# Altium schematic sheet Power.SchDoc
size A3; Author: Ali Zoubir; Organization: ETML-ES; Address1: Avenue Recordon 1; Address2: 1004 Lausanne; Address3: Switzerland; Revision: 2221; SheetNumber: 6; SheetTotal: 6; Version: V0
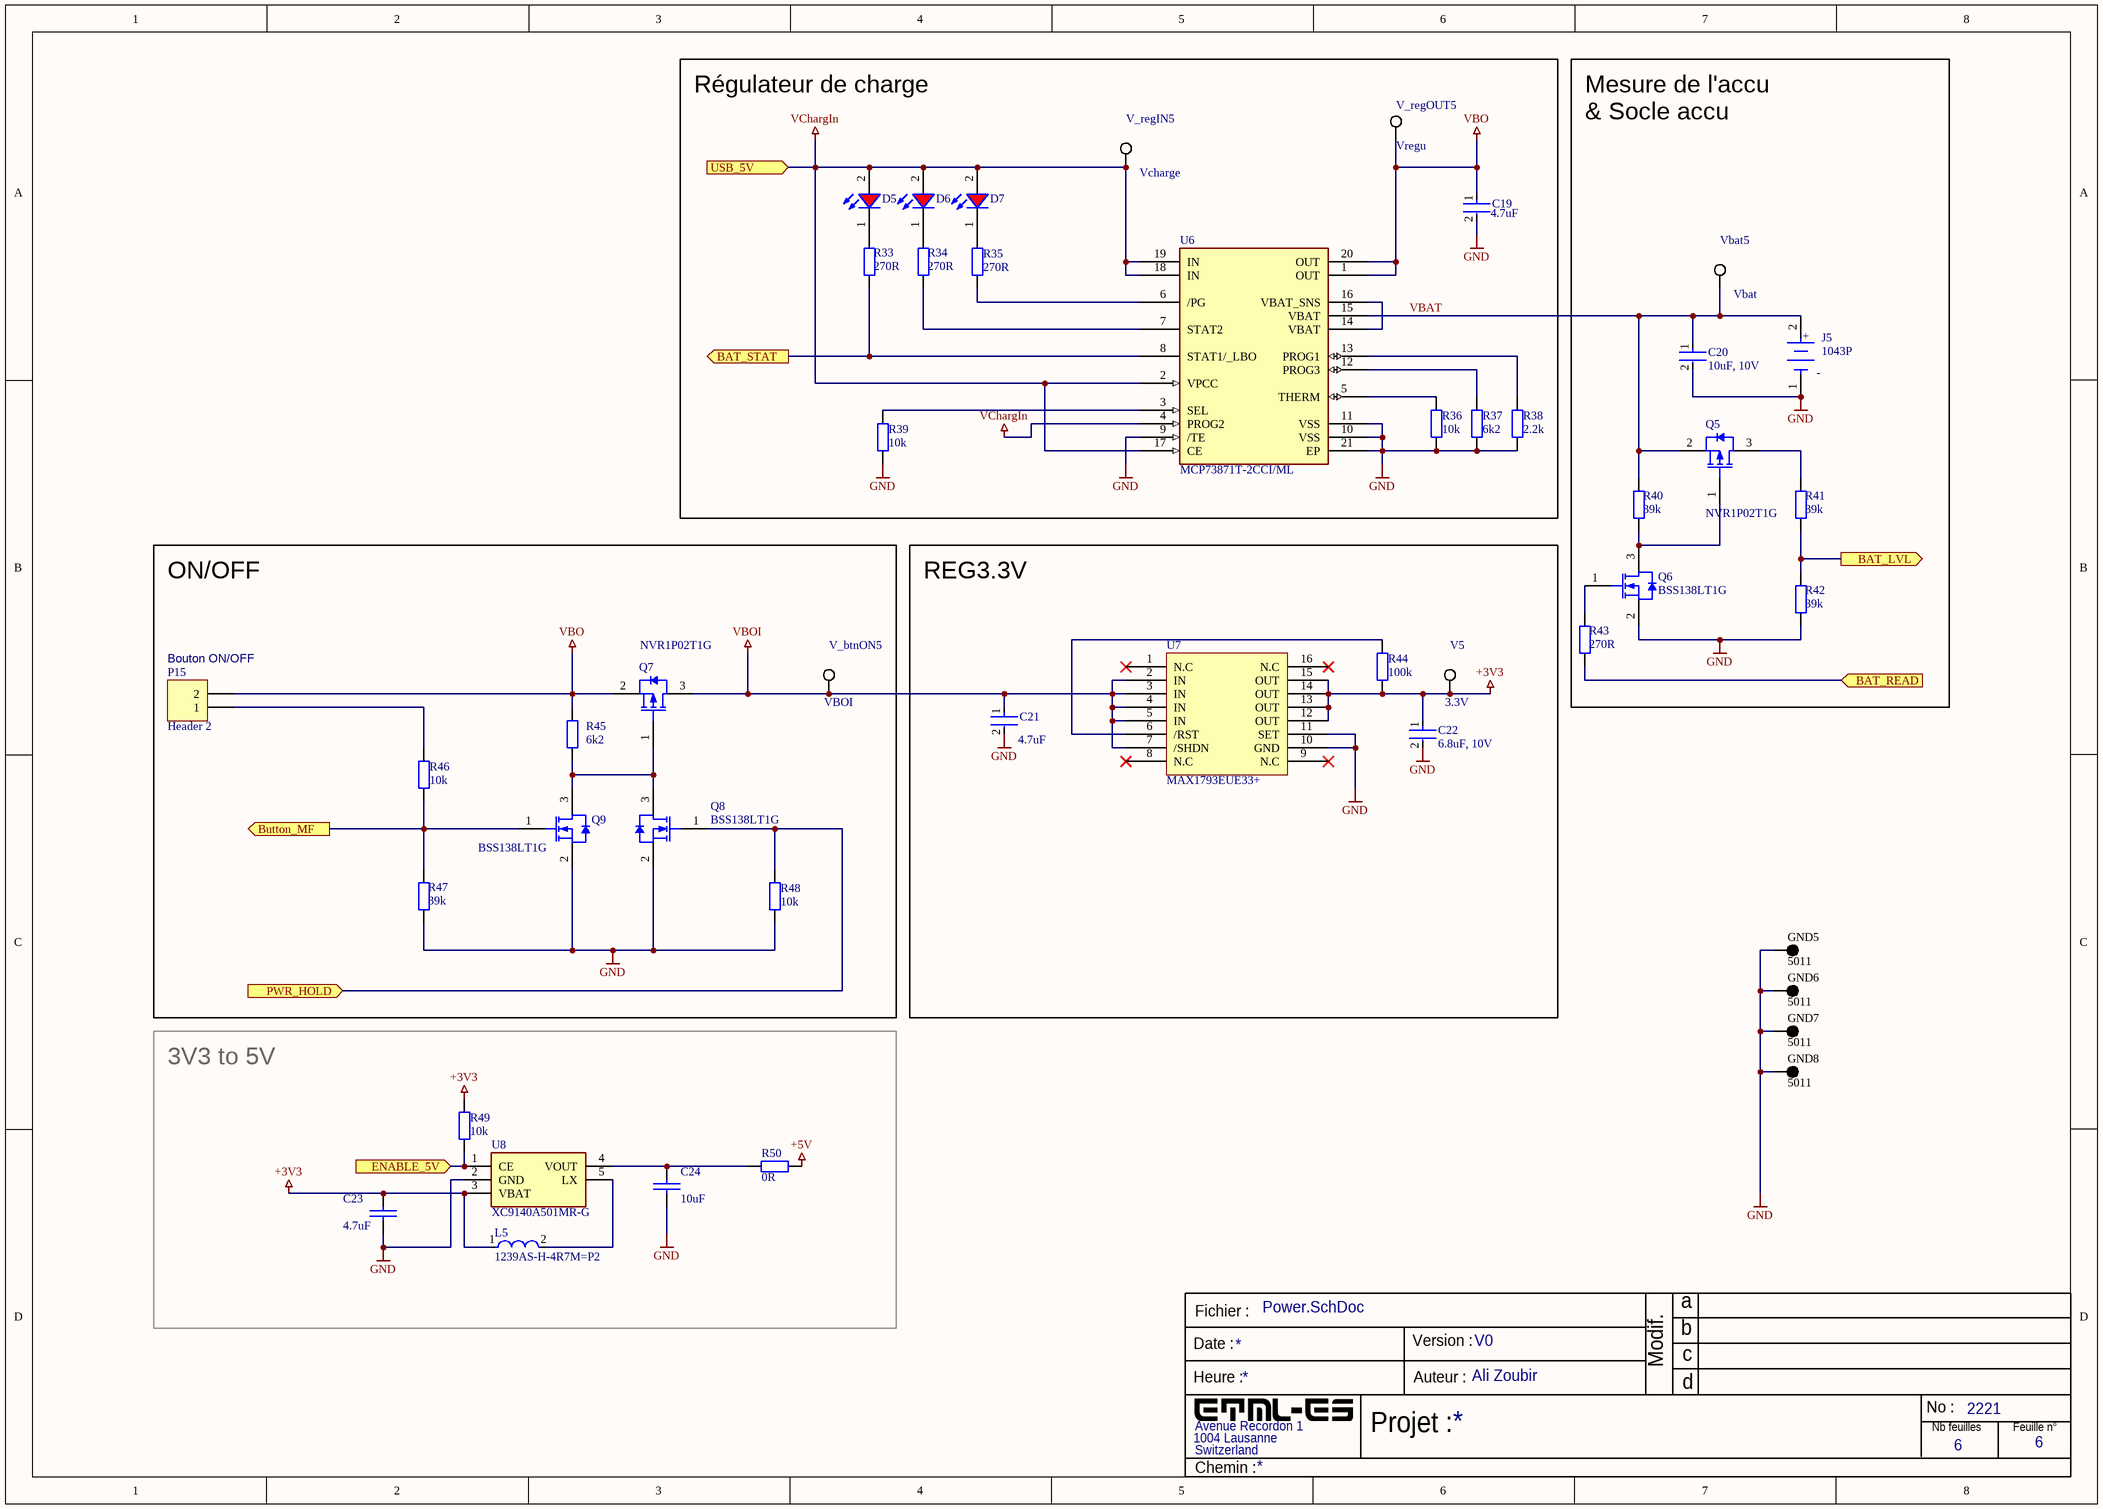
[diagram p0: Power.SchDoc]

## Parts
C19  Capacitance: 4.7uF  [6-0805_L]  (hidden comment: 4.7uF, 35V)
C20  10uF, 10V  [6-0805_L]
C21  Capacitance: 4.7uF  [6-0805_L]  (hidden comment: 4.7uF, 35V)
C22  6.8uF, 10V  [6-0805_L]
C23  4.7uF  [6-0805_L]
C24  10uF  [6-0805_L]
D5  Super Red, 1.9 V  [WL-SMCW_0805_150080xx75000]  (value not drawn)
D6  Super Red, 1.9 V  [WL-SMCW_0805_150080xx75000]  (value not drawn)
D7  Super Red, 1.9 V  [WL-SMCW_0805_150080xx75000]  (value not drawn)
GND5  5011  [KSTN-5011_V]
GND6  5011  [KSTN-5011_V]
GND7  5011  [KSTN-5011_V]
GND8  5011  [KSTN-5011_V]
J5  1043P  [FP-1043P-MFG]
L5  1239AS-H-4R7M=P2  [FP-DFE252012C-IPC_B]
P15  Header 2  [HDR1X2]
Q5  NVR1P02T1G  [ONSC-SOT-23-3-318-08_V]
Q6  BSS138LT1G  [ONSC-SOT-23-3-318-08_V]
Q7  NVR1P02T1G  [ONSC-SOT-23-3-318-08_V]
Q8  BSS138LT1G  [ONSC-SOT-23-3-318-08_V]
Q9  BSS138LT1G  [ONSC-SOT-23-3-318-08_V]
R33  270R  [6-0805_L]
R34  270R  [6-0805_L]
R35  270R  [6-0805_L]
R36  10k  [6-0805_L]
R37  6k2  [6-0805_L]
R38  2.2k  [6-0805_L]
R39  10k  [6-0805_L]
R40  39k  [6-0805_L]
R41  39k  [6-0805_L]
R42  39k  [6-0805_L]
R43  270R  [6-0805_L]
R44  100k  [6-0805_L]
R45  6k2  [6-0805_L]
R46  10k  [6-0805_L]
R47  39k  [6-0805_L]
R48  10k  [6-0805_L]
R49  10k  [6-0805_L]
R50  0R  [6-0805_L]
U6  MCP73871T-2CCI/ML  [Microchip_C04-126_IPC_B]
U7  MAX1793EUE33+  [TSOP65P640X110_HS-17N]
U8  XC9140A501MR-G  [SOT95P280X130-5N]
V5  3.3V  [KSTN-5019_V]
V_btnON5  VBOI  [KSTN-5019_V]
V_regIN5  Vcharge  [KSTN-5019_V]
V_regOUT5  Vregu  [KSTN-5019_V]
Vbat5  Vbat  [KSTN-5019_V]

## Blocks framed on the sheet
Régulateur de charge: C19 D5-D7 R33-R39 U6 V_regIN5 V_regOUT5
ON/OFF: P15 Q7-Q9 R45-R48 V_btnON5
REG3.3V: C21 C22 R44 U7 V5
3V3 to 5V: C23 C24 L5 R49 R50 U8

## Ports
BAT_LVL (out), BAT_READ (in), BAT_STAT (out), Button_MF (out), ENABLE_5V (in), PWR_HOLD (in), USB_5V (in)

## Nets
+3V3: C22.1 C23.1 L5.1 R44.1 R49.2 U7.12(OUT) U7.13(OUT) U7.14(OUT) U7.15(OUT) U8.3(VBAT) V5.1
+5V: R50.1
GND: C19.2 C20.2 C21.2 C22.2 C23.2 C24.2 GND5.1 GND6.1 GND7.1 GND8.1 J5.1(C) Q6.2(S) Q8.2(S) Q9.2(S) R36.1 R37.1 R38.1 R39.1 R42.1 R47.1 R48.1 U6.9(/TE) U6.10(VSS) U6.11(VSS) U6.21(EP) U7.10(GND) U7.11(SET) U8.2(GND)
VBO: C19.1 P15.2 Q7.2(S) R45.2 U6.1(OUT) U6.20(OUT) V_regOUT5.1
VBOI: C21.1 Q7.3(D) U7.2(IN) U7.3(IN) U7.4(IN) U7.5(IN) U7.7(/SHDN) V_btnON5.1
VChargIn: D5.2(A) D6.2(A) D7.2(A) U6.2(VPCC) U6.4(PROG2) U6.17(CE) U6.18(IN) U6.19(IN) V_regIN5.1 ; port USB_5V
BAT_LVL: R41.1 R42.2 ; port BAT_LVL
BAT_READ: R43.1 ; port BAT_READ
BAT_STAT: R33.1 U6.8(STAT1/_LBO) ; port BAT_STAT
Button_MF: Q9.1(G) R46.1 R47.2 ; port Button_MF
ENABLE_5V: R49.1 U8.1(CE) ; port ENABLE_5V
PWR_HOLD: Q8.1(G) R48.2 ; port PWR_HOLD
VBAT: C20.1 J5.2(A) Q5.2(S) R40.2 U6.15(VBAT) Vbat5.1
NetC24_1: C24.1 R50.2 U8.4(VOUT)
NetD5_1: D5.1(K) R33.2
NetD6_1: D6.1(K) R34.2
NetD7_1: D7.1(K) R35.1
NetL5_2: L5.2 U8.5(LX)
NetP15_1: P15.1 R46.2
NetQ5_1: Q5.1(G) Q6.3(D) R40.1
NetQ5_3: Q5.3(D) R41.2
NetQ6_1: Q6.1(G) R43.2
NetQ7_1: Q7.1(G) Q8.3(D) Q9.3(D) R45.1
NetR34_1: R34.1 U6.7(STAT2)
NetR35_2: R35.2 U6.6(/PG)
NetR36_2: R36.2 U6.5(THERM)
NetR37_2: R37.2 U6.12(PROG3)
NetR38_2: R38.2 U6.13(PROG1)
NetR39_2: R39.2 U6.3(SEL)
NetR44_2: R44.2 U7.6(/RST)
NetU6_14: U6.14(VBAT) U6.16(VBAT_SNS)

Not connected (* = marked no-connect by the designer): U7 1(N.C)* 8(N.C)* 9(N.C)* 16(N.C)*

## Notes on the sheet
- Mesure de l'accu
- & Socle accu
- (near P15) Bouton ON/OFF
- Fichier :
- a
- Date :
- Heure :
- Version :
- Auteur :
- Modif.
- b
- c
- d
- Projet :
- No :
- Nb feuilles
- Feuille n°
- Chemin :
- (in symbol CMP-19636-000034-1) +

## Library data of the parts
C19 C21 = CMP-08246-002735-1: Multilayer Ceramic Capacitors 4.7μF ±10% 35V X7R SMD 0805; Tolerance: 10%; Depth: 1.25mm; RoHS Compliant: Yes; Construction: Flat; Radiation Hardening: No; Lead Free: Lead Free; Weight: 0.000194oz; Termination: SMD/SMT; Package Quantity: 2000; Dielectric: X7R; Mount: Surface Mount; Voltage Rating: 35V; Case/Package: 0805; Min Operating Temperature: -55°C; Dielectric Material: Ceramic; REACH SVHC: No SVHC; Series: C; Thickness: 0.057inch; Packaging: Tape and Reel; Case Code (Metric): 2012; Max Operating Temperature: 125°C; Case Code (Imperial): 0805; Height: 1.25mm; Width: 0.049inch; Length: 2mm; Voltage Rating (DC): 35V
C20 = CMP-2007-03243-2: CAP CER 10UF 10V X5R 0805; Manufacturer Part Number: C0805C106K8PACTU; Manufacturer: Kemet; 3DS Part Number: 220-00001; Tolerance: 10%; Temperature Coefficient: 15%; Material: Ceramic; Device Class L2: Capacitors; Device Class L1: Passive Components; ComponentLink2URL: https://content.kemet.com/datasheets/KEM_C1006_X5R_SMD.pdf; Height: 1.4mm; Lead Free: Yes; Digikey Description: CAP CER 10UF 10V X5R 0805; Octopart: https://octopart.com/c0805c106k8pactu-kemet-98697; Capacitance: 10uF; Value: 10uF; Temperature Range Low: -55°C; Temperature: -55°C to +85°C; Automotive: No; Mouser Description: CAP CER 10UF 10V X5R 0805; Ipc Land Pattern Name: CAPC200125X125; Temperature Range High: +85°C; Voltage: 10V; RoHS: TRUE; Device Class L3: Ceramic Capacitors; ComponentLink2Description: Datasheet; Voltage Rating: 10V; Package: C0805C-DG; Temperature Characteristic: X5R; Category: Cap
C22 = CMP-08246-000118-1: Cap Ceramic 6.8uF 10V X5R 20% Pad SMD 0805 +85°C Automotive T/R; Capacitance: 6.8uF; Packaging: Tape and Reel; Package Quantity: 2000; Width: 0.049inch; Voltage Rating (DC): 10V; Case Code (Imperial): 0805; Ratings: AEC-Q200; Min Operating Temperature: -55°C; Tolerance: 20%; Length: 0.079inch; Case/Package: 0805; Thickness: 0.057inch; Weight: 0.000194oz; Voltage Rating: 10V; Dielectric: X5R; Case Code (Metric): 2012; Height: 1.25mm; Max Operating Temperature: 85°C; Mount: Surface Mount
C23 C24 = C: SDTSourceLibName: C:\WINDOWS\TEMP\DA.LIB; PCB Footprint: RC0805
D5-D7 = 150080SS75000: SMT Mono-color Chip LED Waterclear WL-SMCW, size 0805, Super Red, 1.9 V, 140 deg, 60 mcd; Forward Voltage: 1.9 V; Viewing Angle: 140 deg; Peak Wavelength: 645 nm; Dominant Wavelength: 630 nm; Luminous Intensity: 60 mcd; Chip Technology: AlInGaP; ComponentLink1Description: Manufacturer; ComponentLink1URL: http://www.we-online.de; ComponentLink2Description: Datasheet; ComponentLink2URL: https://katalog.we-online.de/led/datasheet/150080SS75000.pdf; Part Number: 150080SS75000; Published Date: November 2018; Publisher: Wurth Elektronik; Size: 0805; Operating Temperature: -40 to 85 degC; Emitting Color: Super Red; Mounting Technology: SMT; Packaging: Tape and Reel; Supplier 1: Digi-Key; Supplier Part Number 1: 732-4985-1-ND; Supplier 2: Distrelec; Supplier Part Number 2: 30008875
GND5-GND8 = CMP-1672-00003-4: Test Point, Black, Through Hole, RoHS, Bulk; Manufacturer: Keystone; ComponentLink2URL: http://www.keyelco.com/product-pdf.cfm?p=1320; Colour: Black; Pins: 1; REACH SVHC: No SVHC; ComponentLink1URL: http://www.keyelco.com/; PackageReference: 5011; Contact Plating: Silver; Package Quantity: 100; Packaging: Bulk; RoHSCompliant: true; Height: 8.12 mm; PackageDescription: 1-Pin Through Hole Device, Dia 3.17 mm; Mount: Through Hole; Mounting Technology: Through Hole; DatasheetVersion: Rev. F, 12/2013; ComponentLink1Description: Manufacturer URL; Contact Material: Bronze; ComponentLink2Description: Datasheet
J5 = CMP-19636-000034-1: BATT HOLDER 18650 1 CELL PC PIN; Number of Cells: 1; Series: -; Termination: PC Pin; Package Quantity: 50; Min Operating Temperature: -50°C; Mount: Through Hole; Packaging: Tray; Max Operating Temperature: 145°C
L5 = CMP-06042-003985-1: Shielded Wirewound Inductor 4.7uH 20% 1300mA 0.24Ω 1008 (2520); Current Rating: 1.5A; Core Material: Ferrite; DC Resistance (DCR): 240mR; Test Frequency: 1MHz; Resistor Type: Wirewound; Mount: Surface Mount; Case/Package: 1008; Case Code (Metric): 2520; Inductance: 4.7uH; Width: 0.079inch; Min Operating Temperature: -40°C; Height - Seated (Max): 0.047inch; Length: 0.098inch; Max Operating Temperature: 85°C; Tolerance: 20%; Case Code (Imperial): 1008; Shielding: Shielded; Packaging: Tape and Reel
P15 = Header 2: Header, 2-Pin; LatestRevisionDate: 17-Jul-2002; LatestRevisionNote: Re-released for DXP Platform.; Publisher: Altium Limited
Q5 Q7 = CMP-1058-00745-1: Power MOSFET, -20 V, -1 A, P-Channel, 3-Pin SOT-23, Pb-Free, Tape and Reel; Manufacturer: On Semiconductor; Ciss Typ (pF): 165; Configuration: Single; VGS(th) Max (V): 2.3; Channel Polarity: P Channel; V(BR)DSS Min (V): 20; ID Max (A): 1; Coss Typ (pF): 110; Qrr Typ (nC): 8; Crss Typ (pF): 35; PD Max (W): 0.4; DatasheetVersion: Rev. 7; ComponentLink1Description: Manufacturer URL; PackageReference: SOT-23-3-318-08; ComponentLink2Description: Datasheet; ComponentLink2URL: http://www.onsemi.cn/pub_link/Collateral/NTR1P02T1-D.PDF; Packing: Tape and Reel; Package Type: SOT-23-3; ComponentLink1URL: http://www.onsemi.com/; RoHS: Pb-Free; PartNumber: NVR1P02T1G; PackageVersion: Rev. AP, 11/2009; PackageDescription: 3-Pin Small Outline Transistor, Body 2.92 x 1.3 mm, Pitch 0.95 mm; ComponentLink3URL: http://www.onsemi.cn/pub_link/Collateral/318-08.PDF; ComponentLink3Description: Package Specification; VGS Max (V): 20; Mounting Technology: Surface Mount
Q6 Q8 Q9 = CMP-1058-00767-1: Power MOSFET, 200 mA, 50 V, N-Channel, 3-Pin SOT-23, Pb-Free, Tape and Reel; Manufacturer: On Semiconductor; PD Max (W): 0.225; Coss Typ (pF): 12; V(BR)DSS Min (V): 50; VGS Max (V): 20; Channel Polarity: N Channel; Configuration: Single; VGS(th) Max (V): 1.5; Ciss Typ (pF): 40; Crss Typ (pF): 3.5; ID Max (A): 0.2; ComponentLink3Description: Package Specification; PackageDescription: 3-Pin Small Outline Transistor, Body 2.92 x 1.3 mm, Pitch 0.95 mm; PackageReference: SOT-23-3-318-08; RoHS: Pb-Free; Mounting Technology: Surface Mount; ComponentLink1Description: Manufacturer URL; ComponentLink2URL: http://www.onsemi.com/pub_link/Collateral/BSS138LT1-D.PDF; ComponentLink2Description: Datasheet; Packing: Tape and Reel; PackageVersion: Rev. AP, 11/2009; PartNumber: BSS138LT1G; Package Type: SOT-23-3; ComponentLink1URL: http://www.onsemi.com/; DatasheetVersion: Rev. 8; ComponentLink3URL: http://www.onsemi.cn/pub_link/Collateral/318-08.PDF
R33-R35 R43 = CMP-2001-00528-1: Res 0805; Part Number: ERJ6ENF2703V; Manufacturer: Panasonic
R36 R39 R46 R48 R49 = CMP-2001-04376-1: Res 0805; Manufacturer: Panasonic; Part Number: ERJ-6ENF1002V
R37 = CMP-2001-04031-1: Res 0805; Manufacturer: Vishay Dale; Part Number: CRCW08055K60JNEA
R38 = CMP-1013-00510-2: Res 0805; Part Number: CRCW08051K00FKEA; Manufacturer: Vishay Dale
R40-R42 R47 = CMP-2001-00410-1: Res 0805; Part Number: ERJ-6GEYJ393V; Manufacturer: Panasonic
R44 = CMP-2001-00479-1: Res 0805; Manufacturer: Panasonic; Part Number: ERJ-P06J104V
R45 = CMP-2001-00562-1: Res 0805; Part Number: ERJ6ENF6201V; Manufacturer: Panasonic
R50 = Res2: Res 0805; Published: 8-Jun-2000; LatestRevisionDate: 17-Jul-2002; LatestRevisionNote: Re-released for DXP Platform.; PackageReference: AXIAL-0.4; Publisher: Altium Limited; PackageDescription: Axial Device, Thru-Hole; 2 Leads; 0.4 in Pin Spacing; Value: 0R
U6 = MCP73871T-2CCI/ML: Charger IC Lithium Ion/Polymer 20-QFN _4x4_; MF: Microchip; SnapEDA_Link: https://www.snapeda.com/parts/MCP73871T-2CCI/ML/Microchip/view-part/1049920/?ref=snap; Value: *; Digi-Key_Part_Number: MCP73871T-2CCI/MLCT-ND; MP: MCP73871T-2CCI/ML; Digi-Key_Purchase_URL: https://www.digikey.com/product-detail/en/microchip-technology/MCP73871T-2CCI-ML/MCP73871T-2CCI-MLCT-ND/7065594?utm_source=snapeda&utm_medium=aggregator&utm_campaign=symbol; Package: QFN-20 Microchip
U8 = XC9140A501MR-G: Switching Voltage Regulators PFM Control Snchrns StepUpDCDC Converter; Manufacturer_Name: Torex; Geometry.Height: 1.3mm; Mouser Part Number: 865-XC9140A501MR-G; Mouser Price/Stock: https://www.mouser.co.uk/ProductDetail/Torex-Semiconductor/XC9140A501MR-G?qs=AsjdqWjXhJ8xw9tvUM0FMA%3D%3D; Manufacturer_Part_Number: XC9140A501MR-G; Datasheet Link: *
V5 V_btnON5 V_regIN5 V_regOUT5 Vbat5 = CMP-1672-00008-1: Test Point, 1 Position SMD, RoHS, Tape and Reel; ComponentLink1Description: Manufacturer URL; Package Quantity: 1000; DatasheetVersion: 03/2014; Packaging: Tape and Reel; ComponentLink2URL: http://www.keyelco.com/product-pdf.cfm?p=1357; ComponentLink1URL: http://www.keyelco.com/; Mount: Surface Mount; Contact Plating: Silver; PackageDescription: 1-Pin Surface Mount Device, Body 3.81 x 2.03 mm; Pins: 1; RoHSCompliant: True; Mounting Technology: Surface Mount; ComponentLink2Description: Datasheet; PackageReference: 5019